# EAGLE design LPC_4TE_3.50controller (EAGLE 5.00)
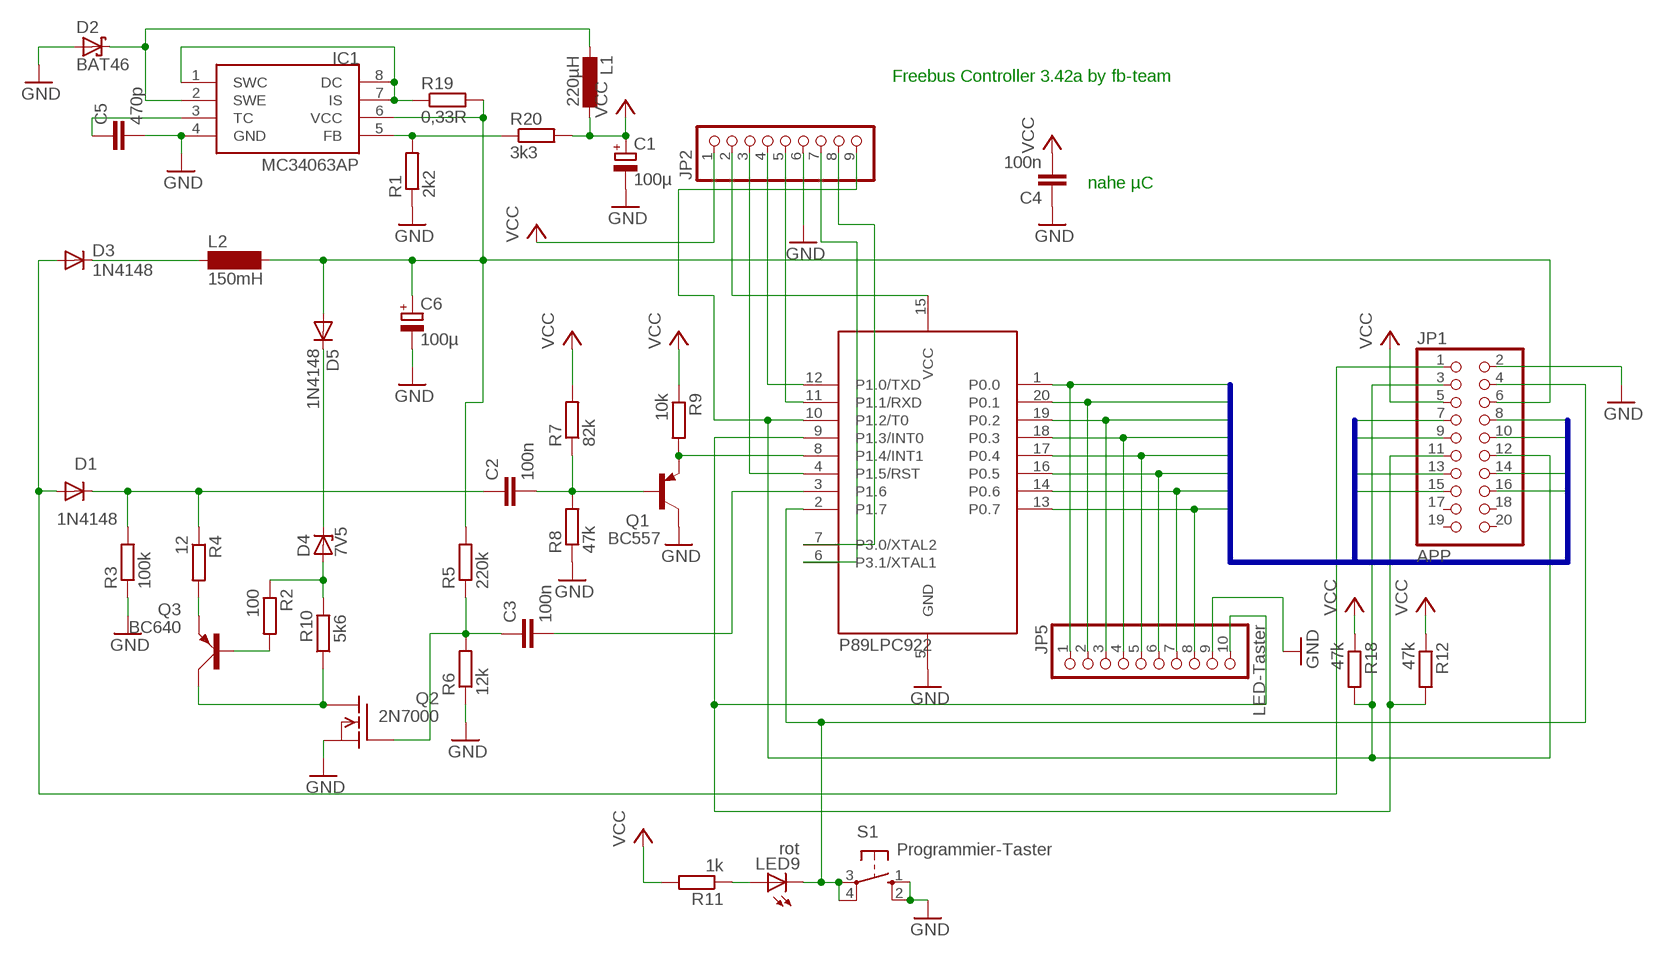
[diagram p0: schematic, sheet 1]

## Parts
C1  100µ  CPOL-EUE5-8.5  [E5-8,5]
C2  100n  C-EU050-024X044  [C050-024X044]
C3  100n  C-EU050-024X044  [C050-024X044]
C4  100n  C-EU050-024X044  [C050-024X044]
C5  470p  C-EU025-024X044  [C025-024X044]
C6  100µ  CPOL-EUE5-8.5  [E5-8,5]
D1  1N4148  [DO35-10]
D2  BAT46  BAT49  [DO41-10]
D3  1N4148  [DO35-10]
D4  7V5  ZPD  [DO35Z10]
D5  1N4148  [DO35-10]
IC1  MC34063AP  [DIL08]
JP1  APP  PINHD-2X10  [2X10]
JP2  PINHD-1X9  [1X09]
JP5  LED-Taster  PINHD-1X10  [1X10]
L1  220µH  L-EU2200-12.7  [2200-12.7]
L2  150mH  SD12-1000  [SD12_1000]
LED9  rot  LED3MM  [LED3MM]
Q1  BC557  [TO92]
Q2  2N7000  VN2222KM  [TO237]
Q3  BC640  [SOT54D]
R1  2k2  R-EU_0207/10  [0207/10]
R2  100  R-EU_0207/10  [0207/10]
R3  100k  R-EU_0207/10  [0207/10]
R4  12  R-EU_0207/10  [0207/10]
R5  220k  R-EU_0207/10  [0207/10]
R6  12k  R-EU_0207/10  [0207/10]
R7  82k  R-EU_0207/10  [0207/10]
R8  47k  R-EU_0207/10  [0207/10]
R9  10k  R-EU_0207/10  [0207/10]
R10  5k6  R-EU_0207/10  [0207/10]
R11  1k  R-EU_0207/10  [0207/10]
R12  47k  R-EU_0207/10  [0207/10]
R18  47k  R-EU_0207/10  [0207/10]
R19  0,33R  R-EU_0207/10  [0207/10]
R20  3k3  R-EU_0207/10  [0207/10]
S1  Programmier-Taster  10-XX  [B3F-10XX]
U1  89LPC922  [DIL20]

## Nets
GND: C1.- C4.1 C5.2 C6.- D2.A IC1.4(GND) JP1.2 JP2.6 JP5.9 Q1.3(C) Q2.3(S) R1.1 R3.1 R6.1 R8.1 S1.1(S) S1.2(S1) U1.5(GND)
N$1: Q1.1(E) R9.2 U1.8(P1.4/INT1)
N$2: C2.2 Q1.2(B) R7.1 R8.2
N$3: IC1.5(FB) R1.2 R20.1
N$4: IC1.1(SWC) IC1.7(IS) IC1.8(DC) R19.1
N$5: C3.2 U1.3(P1.6)
N$6: Q2.1(D) Q3.C R10.1
N$7: C6.+ D5.A IC1.6(VCC) JP1.6 L2.2 R5.2 R19.2
N$8: D3.C L2.1
N$9: C2.1 D1.C R3.2 R4.1
N$10: D2.C IC1.2(SWE) L1.2
N$11: D4.A R2.1 R10.2
N$12: Q3.E R4.2
N$13: C5.1 IC1.3(TC)
N$14: Q3.B R2.2
N$15: JP1.11 JP5.10 R12.2 U1.9(P1.3/INT0)
N$16: D1.A D3.A JP1.1
N$17: JP1.4 LED9.K(C) S1.3(P) S1.4(P1) U1.2(P1.7)
N$19: JP2.7 U1.6(P3.1/XTAL1)
N$20: JP2.8 U1.7(P3.0/XTAL2)
N$29: JP2.4 U1.12(P1.0/TXD)
N$30: JP2.5 U1.11(P1.1/RXD)
N$31: JP2.3 U1.4(P1.5/RST)
N$32: JP2.2 U1.15(VCC)
N$33: JP1.3 JP1.12 JP2.9 R18.2 U1.10(P1.2/T0)
N$34: C3.1 Q2.2(G) R5.1 R6.2
N$40: D4.C D5.C
N$41: LED9.A R11.1
P0.0: JP1.7 JP5.1 U1.1(P0.0)
P0.1: JP1.8 JP5.2 U1.20(P0.1)
P0.2: JP1.9 JP5.3 U1.19(P0.2)
P0.3: JP1.10 JP5.4 U1.18(P0.3)
P0.4: JP1.13 JP5.5 U1.17(P0.4)
P0.5: JP1.14 JP5.6 U1.16(P0.5)
P0.6: JP1.15 JP5.7 U1.14(P0.6)
P0.7: JP1.16 JP5.8 U1.13(P0.7)
VCC: C1.+ C4.2 JP1.5 JP2.1 L1.1 R7.2 R9.1 R11.2 R12.1 R18.1 R20.2
Unconnected: JP1.17 JP1.18 JP1.19 JP1.20

## Buses
P0.[0..7]

## Notes on the sheet
- Freebus Controller 3.42a by fb-team
- nahe µC
- P89LPC922

## Library data of the parts
C1 C6 = rcl:CPOL-EU: POLARIZED CAPACITOR, European symbol
C2-C5 = rcl:C-EU: CAPACITOR, European symbol
D1 D3 D5 = diode:1N4148: DIODE high speed (Philips)
D2 = diode:BAT49: DIODE small signal diode
D4 = diode:ZPD: Z DIODE 500 mW
IC1 = mc34063:MC34063
JP1 = pinhead:PINHD-2X10: PIN HEADER
JP2 = pinhead:PINHD-1X9: PIN HEADER
JP5 = pinhead:PINHD-1X10: PIN HEADER
L1 = rcl:L-EU: INDUCTOR, European symbol
L2 = inductor-neosid:SD12: INDUCTOR nominal inductance
LED9 = led:LED: LED OSRAM: - CHIPLED LG R971, LG N971, LY N971, LG Q971, LY Q971, LO R971, LY R971 LH N974, LH R974 LS Q976, LO Q976, LY Q976 LO Q996 - Hyper CHIPLED LW Q18S LB Q993, LB Q99A, LB R99A - SideLED LS A670, LO A670, LY A670, LG A670, LP A670 LB A673, LV A673, LT A673, LW A673 LH A674 LY A675 LS A676, LA A676, LO A676, LY A676, LW A676 LS A679, LY A679, LG A679 - Hyper Micro SIDELED® LS Y876, LA Y876, LO Y876, LY Y876 LT Y87S - SmartLED LW L88C, LW L88S LB L89C, LB L89S, LG L890 LS L89K, LO L89K, LY L89K LS L896, LA L896, LO L896, LY L896 - TOPLED LS T670, LO T670, LY T670, LG T670, LP T670 LSG T670, LSP T670, LSY T670, LOP T670, LYG T670 LG T671, LOG T671, LSG T671 LB T673, LV T673, LT T673, LW T673 LH T674 LS T676, LA T676, LO T676, LY T676, LB T676, LH T676, LSB T676, LW T676 LB T67C, LV T67C, LT T67C, LS T67K, LO T67K, LY T67K, LW E67C LS E67B, LA E67B, LO E67B, LY E67B, LB E67C, LV E67C, LT E67C LW T67C LS T679, LY T679, LG T679 LS T770, LO T770, LY T770, LG T770, LP T770 LB T773, LV T773, LT T773, LW T773 LH T774 LS E675, LA E675, LY E675, LS T675 LS T776, LA T776, LO T776, LY T776, LB T776 LHGB T686 LT T68C, LB T68C - Hyper Mini TOPLED® LB M676 - Mini TOPLED Santana® LG M470 LS M47K, LO M47K, LY M47K Source: http://www.osram.convergy.de - LUMILED® LXK2-PW12-R00, LXK2-PW12-S00, LXK2-PW14-U00, LXK2-PW14-V00 LXK2-PM12-R00, LXK2-PM12-S00, LXK2-PM14-U00 LXK2-PE12-Q00, LXK2-PE12-R00, LXK2-PE12-S00, LXK2-PE14-T00, LXK2-PE14-U00 LXK2-PB12-K00, LXK2-PB12-L00, LXK2-PB12-M00, LXK2-PB14-N00, LXK2-PB14-P00, LXK2-PB14-Q00 LXK2-PR12-L00, LXK2-PR12-M00, LXK2-PR14-Q00, LXK2-PR14-R00 LXK2-PD12-Q00, LXK2-PD12-R00, LXK2-PD12-S00 LXK2-PH12-R00, LXK2-PH12-S00 LXK2-PL12-P00, LXK2-PL12-Q00, LXK2-PL12-R00 Source: www.luxeon.com
Q1 = transistor-pnp:BC557: PNP Transistor
Q2 = transistor-fet:VN2222KM: N-Channel Enhancement MOSFET (VMOS); 60V; 0,5A; 7,5Ohm
Q3 = transistor-small-signal:BC640: PNP TRANSISTOR
R1-R12 R18-R20 = rcl:R-EU_: RESISTOR, European symbol
S1 = switch-omron:10-XX: OMRON SWITCH
U1 = micro-philips:89LPC922

## Board
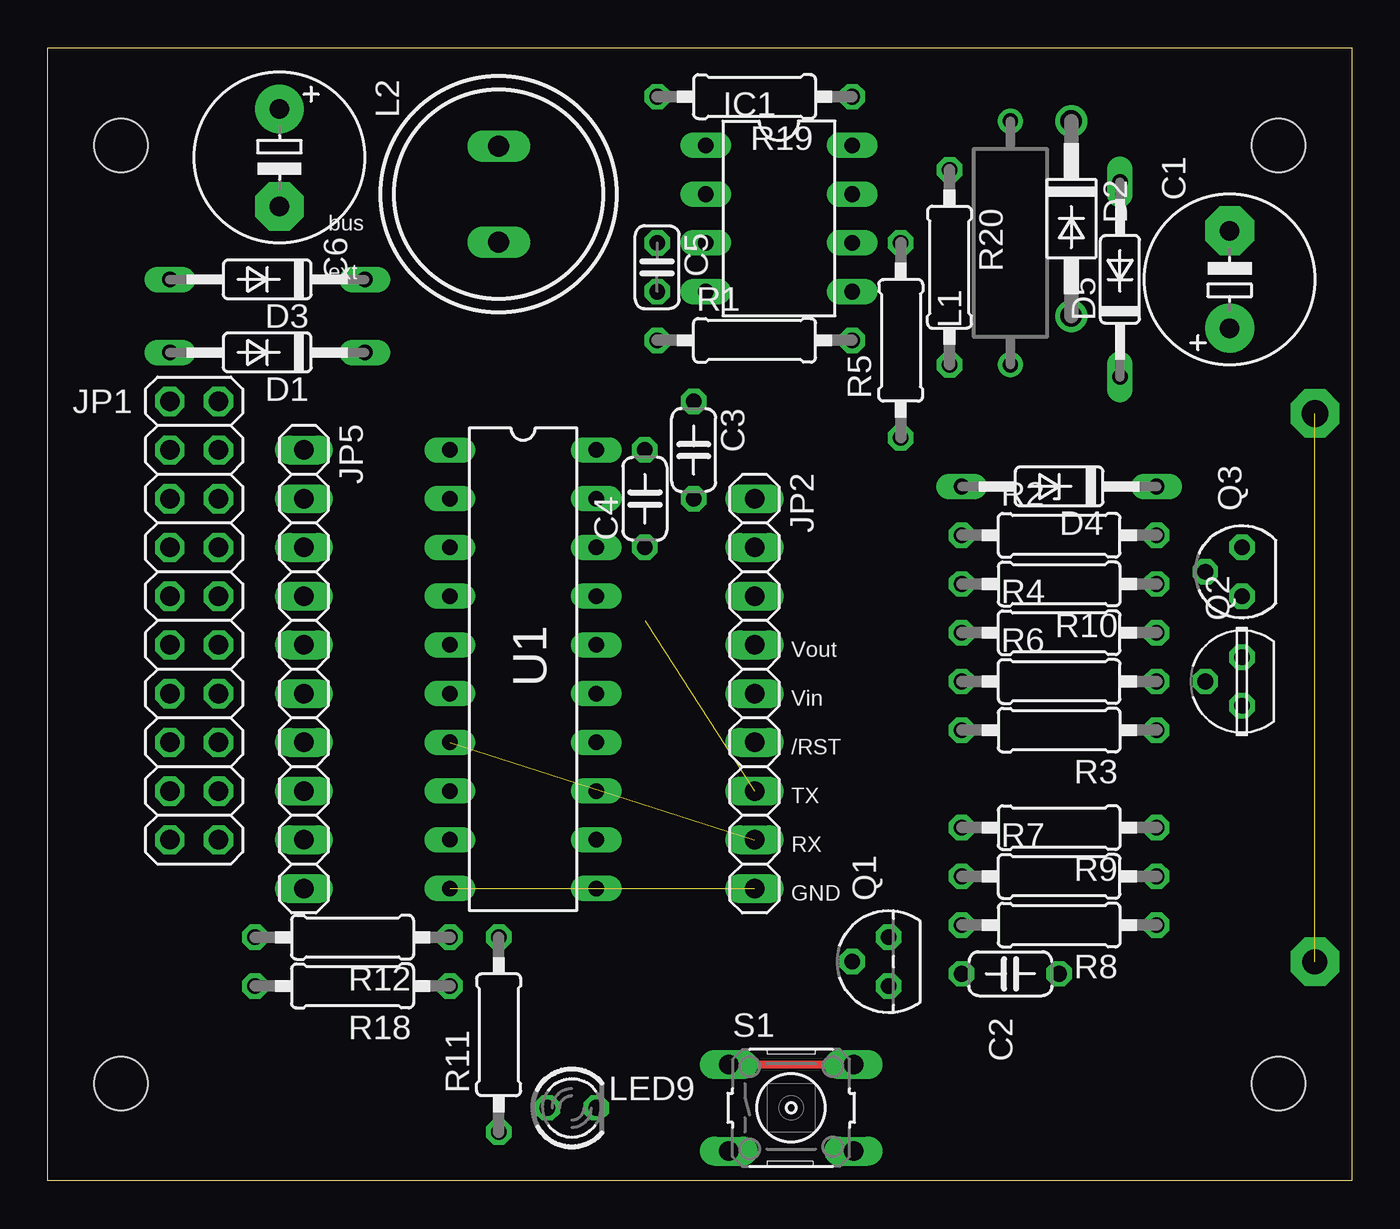
[diagram p1: board, top side]
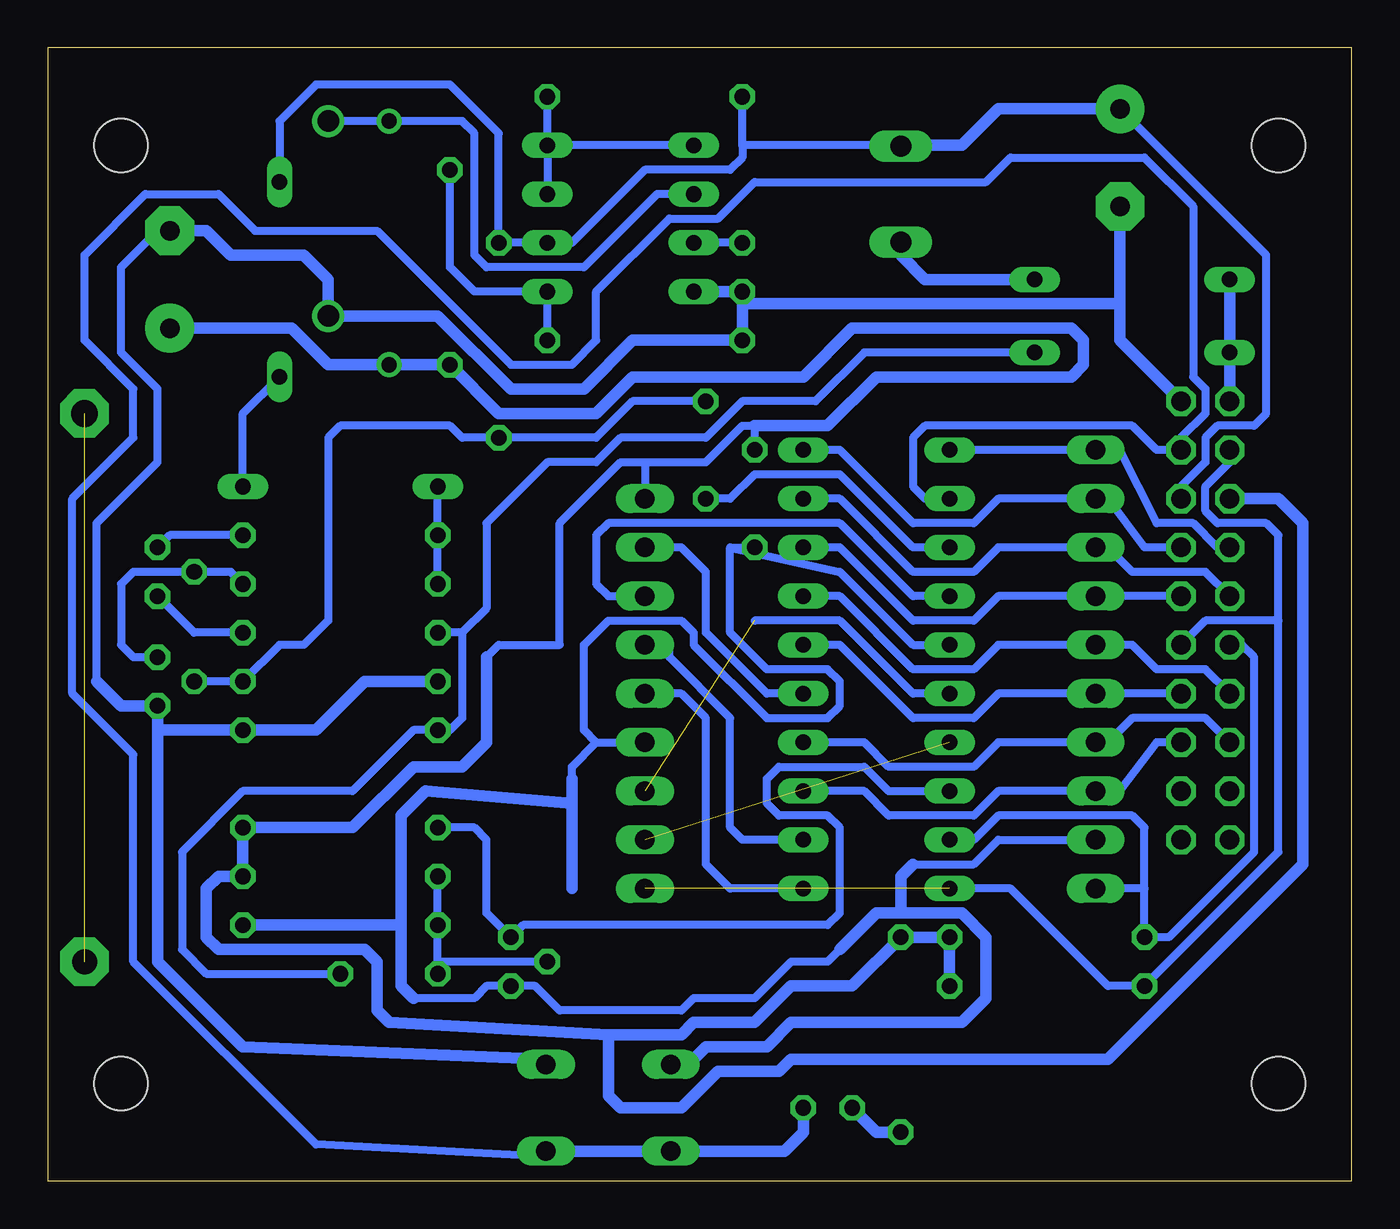
[diagram p2: board, bottom side, seen from below]

Size 67.94 x 59.05 mm. Coordinates in mm from the lower left corner, seen from the top.
Outline: 0,0 0,59.05 67.94,59.05 67.94,0 0,0
Copper layers (1*16): Top 0.035mm / dielectric 1.5mm / Bottom 0.035mm
Design rules "default *": minimum track width 10mil, minimum drill 24mil, track to track 12mil, track to pad 12mil, pad to pad 12mil, via to via 12mil, smd to smd 8mil, copper to edge 20mil, drill to drill 8mil, minimum pad ring 10mil, minimum via ring 8mil, stop-mask expansion 4mil, vias tented up to drill 0mil, thermal gap 10mil
Holes 2.8 mm at 3.81,53.98 64.14,53.98 64.14,5.08 3.81,5.08

### Footprints (pad centres in the part's own frame; a part is rotated, then mirrored left to right if it is on the bottom)
E5-8,5 = drill 1.016 pad 2.54 round: + -2.54,0 | drill 1.016 pad 2.54 octagon: - 2.54,0
C050-024X044 = drill 0.813 octagon: 1 -2.54,0; 2 2.54,0
C025-024X044 = drill 0.813 octagon: 1 -1.27,0; 2 1.27,0
DO35-10 = drill 0.813 long: A 5.08,0; C -5.08,0
DO41-10 = drill 1.118 round: A 5.08,0; C -5.08,0
DO35Z10 = drill 0.813 long: A 5.08,0; C -5.08,0
DIL08 = drill 0.813 long: 1 -3.81,-3.81; 2 -1.27,-3.81; 3 1.27,-3.81; 4 3.81,-3.81; 5 3.81,3.81; 6 1.27,3.81; 7 -1.27,3.81; 8 -3.81,3.81
2X10 = drill 1.016 octagon: 1 -11.43,-1.27; 2 -11.43,1.27; 3 -8.89,-1.27; 4 -8.89,1.27; 5 -6.35,-1.27; 6 -6.35,1.27; 7 -3.81,-1.27; 8 -3.81,1.27; 9 -1.27,-1.27; 10 -1.27,1.27; 11 1.27,-1.27; 12 1.27,1.27; 13 3.81,-1.27; 14 3.81,1.27; 15 6.35,-1.27; 16 6.35,1.27; 17 8.89,-1.27; 18 8.89,1.27; 19 11.43,-1.27; 20 11.43,1.27
1X09 = drill 1.016 long: 1 -10.16,0; 2 -7.62,0; 3 -5.08,0; 4 -2.54,0; 5 0,0; 6 2.54,0; 7 5.08,0; 8 7.62,0; 9 10.16,0
1X10 = drill 1.016 long: 1 -11.43,0; 2 -8.89,0; 3 -6.35,0; 4 -3.81,0; 5 -1.27,0; 6 1.27,0; 7 3.81,0; 8 6.35,0; 9 8.89,0; 10 11.43,0
2200-12.7 = drill 0.8 pad 1.27 round: 1 -6.35,0; 2 6.35,0
SD12_1000 = drill 1.1 long: 1 -2.5,0; 2 2.5,0
LED3MM = drill 0.813 octagon: A -1.27,0; K 1.27,0
TO92 = drill 0.813 octagon: 1 1.27,0; 2 0,1.905; 3 -1.27,0
TO237 = drill 0.813 octagon: 1 1.27,0; 2 0,1.905; 3 -1.27,0
SOT54D = drill 0.813 octagon: B 1.27,0; C 0,1.905; E -1.27,0
0207/10 = drill 0.813 octagon: 1 -5.08,0; 2 5.08,0
B3F-10XX = drill 1.016 long: 1 -3.251,2.261; 2 3.251,2.261; 3 -3.251,-2.261; 4 3.251,-2.261
DIL20 = drill 0.813 long: 1 -11.43,-3.81; 2 -8.89,-3.81; 3 -6.35,-3.81; 4 -3.81,-3.81; 5 -1.27,-3.81; 6 1.27,-3.81; 7 3.81,-3.81; 8 6.35,-3.81; 9 8.89,-3.81; 10 11.43,-3.81; 11 11.43,3.81; 12 8.89,3.81; 13 6.35,3.81; 14 3.81,3.81; 15 1.27,3.81; 16 -1.27,3.81; 17 -3.81,3.81; 18 -6.35,3.81; 19 -8.89,3.81; 20 -11.43,3.81

### Placement (x,y rotation side)
C1  61.59,46.99 90 top
C2  50.16,10.79 180 top
C3  33.66,38.1 270 top
C4  31.11,35.56 90 top
C5  31.75,47.62 270 top
C6  12.06,53.34 270 top
D1  11.43,43.18 180 top
D2  53.34,50.16 270 top
D3  11.43,46.99 180 top
D4  52.7,36.2 180 top
D5  55.88,46.99 90 top
IC1  38.1,50.16 270 top
JP1  7.62,29.21 270 top
JP2  36.83,25.4 270 top
JP5  13.34,26.67 270 top
L1  50.16,48.9 90 top
L2  23.5,51.44 90 top
LED9  27.3,3.81 0 top
Q1  43.81,11.43 90 top
Q2  62.23,26.04 90 top
Q3  62.23,31.75 90 top
R1  36.83,43.81 0 top
R2  52.7,33.66 0 top
R3  52.7,23.5 180 top
R4  52.7,28.57 0 top
R5  44.45,43.81 90 top
R6  52.7,26.04 0 top
R7  52.7,15.88 0 top
R8  52.7,13.34 180 top
R9  52.7,18.41 180 top
R10  52.7,31.11 180 top
R11  23.5,7.62 90 top
R12  15.88,12.7 180 top
R18  15.88,10.16 180 top
R19  36.83,56.52 180 top
R20  46.99,47.62 270 top
S1  38.73,3.81 0 top
U1  24.77,26.67 270 top

### Tracks (layer width: path | path; a pad name or v marks a point on that pad's centre or on a via)
GND  (1 unrouted)
  Top 0.406: S1.2 35.92,6.07 35.56,5.71 35.48,5.79 S1.1 35.48,6.27 35.56,6.35
  Bottom 0.406: U1.5 22.86,27.94 26.67,31.75 32.38,33.02 | JP5.9 18.41,17.78 19.68,16.51 22.86,16.51 | 32.38,33.02 C4.1 | 32.38,33.02 32.38,28.57 30.48,26.67 27.3,26.67 26.67,26.04 26.67,24.77 27.3,24.13 30.48,24.13 34.29,27.94 34.29,28.57 34.92,29.21 38.73,29.21 40.01,27.94 40.01,23.5 39.37,22.86 | 65.41,26.04 65.41,34.29 62.23,37.47 62.23,41.27 64.14,43.18 64.14,47.62 62.23,49.53 C1.- | 39.37,22.86 JP2.6 | 40.64,20.95 40.64,21.59 39.37,22.86 | 48.9,9.53 45.72,9.53 45.09,10.16 Q1.3 42.55,10.16 41.27,8.89 34.92,8.89 34.29,9.53 31.11,9.53 29.21,11.43 27.3,11.43 26.67,12.06
  Bottom 0.61: JP1.2 12.06,43.81 12.06,45.72 | 12.06,45.72 C6.- | 40.64,19.68 40.64,20.95 | 40.64,19.68 40.64,15.24 | 48.9,9.53 49.53,10.16 49.53,13.34 | 49.53,13.34 49.53,19.05 48.26,20.32 40.64,19.68 | 49.53,13.34 R8.1 | 23.5,13.97 20.32,13.97 19.05,12.7 19.05,9.53 20.32,8.26 29.21,8.26 30.48,6.99 33.66,6.99 34.29,6.35 35.56,6.35 35.48,6.27 | 23.5,13.97 23.5,15.88 22.86,16.51 | 26.67,12.06 24.77,13.97 23.5,13.97 | S1.2 41.99,6.27 41.91,6.35 57.78,6.99 62.23,11.43 62.23,23.5 | C1.- 59.69,49.53 58.42,48.26 54.61,48.26 53.34,46.99 D2.A 47.62,45.09 43.81,41.27 40.01,41.27 37.47,43.81 R1.1 31.75,45.72 | R6.1 51.44,26.04 53.98,23.5 R3.1 62.23,23.5 | 65.41,26.04 64.14,24.77 Q2.3 62.23,23.5 | IC1.4 C5.2 31.75,45.72 | 31.75,45.72 12.06,45.72
N$1
  Bottom 0.406: U1.8 24.13,20.32 25.4,21.59 29.84,21.59 30.48,20.95 30.48,19.68 29.84,19.05 27.3,19.05 26.67,18.41 26.67,13.97 27.3,13.34 43.18,13.34 Q1.1 45.09,13.97 45.09,17.78 45.72,18.41 R9.2
N$2
  Bottom 0.406: 47.62,11.43 C2.2 | 47.62,11.43 R8.2 R7.1 | Q1.2 47.62,11.43
N$3
  Bottom 0.406: R1.2 IC1.5 45.72,46.35 46.99,47.62 R20.1
N$4
  Bottom 0.406: IC1.1 IC1.8 | IC1.8 IC1.7 | IC1.8 R19.1
N$5
  Bottom 0.406: U1.3 22.86,33.02 26.67,36.83 31.11,36.83 32.38,35.56 C3.2
N$6
  Bottom 0.406: R10.1 58.42,31.75 Q3.C 63.5,31.75 64.14,31.11 64.14,27.94 63.5,27.3 Q2.1
N$7
  Bottom 0.406: JP1.6 8.89,36.2 7.62,37.47 7.62,38.73 6.99,39.37 5.08,39.37 4.45,40.01 4.45,48.26 C6.+ | D5.A 55.88,55.24 53.98,57.15 46.99,57.15 44.45,54.61 R5.2 IC1.6 40.64,48.9 36.83,52.7 32.38,52.7 31.75,53.34 31.75,53.98 | 31.75,53.98 R19.2 | 23.5,53.98 31.75,53.98
  Bottom 0.61: C6.+ 18.41,55.88 20.32,53.98 23.5,53.98 L2.2
N$8
  Bottom 0.61: D3.C 22.23,46.99 23.5,48.26 L2.1
N$9
  Bottom 0.406: C2.1 59.69,10.79 60.96,12.06 60.96,17.14 57.78,20.32 52.07,20.32 48.9,23.5 R3.2 46.99,23.5 46.35,24.13 46.35,28.57 | 46.35,28.57 R4.1 | D1.C 25.4,43.18 27.94,40.64 31.75,40.64 33.66,38.73 38.1,38.73 39.37,37.47 41.91,37.47 45.09,34.29 45.09,29.84 46.35,28.57
N$10
  Bottom 0.406: IC1.2 36.2,51.44 40.01,47.62 45.09,47.62 45.72,48.26 45.72,54.61 46.35,55.24 L1.2 D2.C
N$11
  Bottom 0.406: D4.A R2.1 R10.2
N$12
  Bottom 0.406: R4.2 60.33,28.57 Q3.E
N$13
  Bottom 0.406: C5.1 IC1.3
N$14
  Bottom 0.406: Q3.B 61.59,33.66 R2.2
N$15
  Bottom 0.406: U1.9 19.68,17.78 18.41,19.05 11.43,19.05 10.79,18.41 10.79,15.24 | JP1.11 5.71,27.94 5.08,27.3 5.08,17.14 9.53,12.7 R12.2 10.79,15.24 | 10.79,15.24 JP5.10
N$16
  Bottom 0.61: JP1.1 D1.A D3.A
N$17
  Bottom 0.406: U1.2 22.23,35.56 22.86,36.2 22.86,38.73 22.23,39.37 11.43,39.37 10.16,38.1 JP1.4 8.89,38.73 7.62,40.01 7.62,41.27 8.26,41.91 8.26,50.8 10.79,53.34 17.78,53.34 19.05,52.07 31.11,52.07 33.02,50.16 35.56,50.16 39.37,46.35 39.37,43.81 40.64,42.55 43.81,42.55 50.8,49.53 57.15,49.53 59.05,51.44 62.87,51.44 66.04,48.26 66.04,43.81 63.5,41.27 63.5,38.73 66.67,35.56 66.67,25.4 63.5,22.23 63.5,11.43 53.98,1.91 41.91,1.27 41.99,1.35 S1.4
  Bottom 0.61: 35.56,1.55 S1.3 29.57,1.55 28.57,2.54 LED9.K | 35.56,1.55 S1.4 | 35.56,1.55 35.56,1.27
N$18  (via drill 1.3 pad 2.54, 1.4 pad 2.54)  (1 unrouted)
  other vias: 66.04,11.43 66.04,40.01
N$19  (1 unrouted)
  Bottom 0.406: U1.6 22.86,25.4 26.67,29.21 31.11,29.21
N$20  (1 unrouted)
N$29
  Bottom 0.406: 29.84,17.78 U1.12 31.75,17.78 32.38,18.41 32.38,24.13 35.56,27.3 35.56,27.94 JP2.4
N$30
  Bottom 0.406: JP2.5 34.92,25.4 33.66,24.13 33.66,16.51 32.38,15.24 U1.11
N$31
  Bottom 0.406: U1.4 22.86,30.48 26.67,34.29 38.73,34.29 39.37,33.66 39.37,31.11 38.73,30.48 JP2.3
N$32
  Bottom 0.406: U1.15 30.48,25.4 33.66,28.57 33.66,31.75 34.92,33.02 JP2.2
N$33  (1 unrouted)
  Bottom 0.406: U1.10 17.78,15.24 12.7,10.16 R18.2 3.81,17.14 3.81,29.21 | 3.81,29.21 7.62,29.21 JP1.12 | JP1.3 6.35,37.47 7.62,36.2 7.62,34.92 6.99,34.29 4.45,34.29 3.81,33.66 3.81,29.21
N$34
  Bottom 0.406: Q2.2 R6.2 55.88,27.94 54.61,27.94 53.34,29.21 53.34,38.73 52.7,39.37 46.99,39.37 46.35,38.73 R5.1 39.37,38.73 37.47,40.64 C3.1
N$40
  Bottom 0.406: D5.C 57.78,40.01 D4.C
N$41
  Bottom 0.61: R11.1 24.77,2.54 LED9.A
P0.0
  Bottom 0.406: JP1.7 6.99,33.02 8.26,34.29 10.16,34.29 12.06,38.1 JP5.1 U1.1
P0.1
  Bottom 0.406: U1.20 26.67,38.1 22.86,34.29 19.68,34.29 18.41,35.56 JP5.2 12.7,35.56 10.79,33.02 JP1.8
P0.2
  Bottom 0.406: JP1.9 7.62,31.75 11.43,31.75 12.7,33.02 JP5.3 18.41,33.02 19.68,31.75 22.86,31.75 26.67,35.56 U1.19
P0.3
  Bottom 0.406: U1.18 26.67,33.02 22.86,29.21 19.68,29.21 18.41,30.48 JP5.4 JP1.10
P0.4
  Bottom 0.406: JP1.13 7.62,26.67 10.16,26.67 11.43,27.94 JP5.5 18.41,27.94 19.68,26.67 22.86,26.67 26.67,30.48 U1.17
P0.5
  Bottom 0.406: U1.16 26.67,27.94 22.86,24.13 19.68,24.13 18.41,25.4 JP5.6 JP1.14
P0.6
  Bottom 0.406: JP1.15 7.62,24.13 11.43,24.13 12.7,22.86 JP5.7 18.41,22.86 19.68,21.59 24.13,21.59 25.4,22.86 U1.14
P0.7
  Bottom 0.406: U1.13 25.4,20.32 24.13,19.05 19.68,19.05 18.41,20.32 JP5.8 12.06,20.32 10.16,22.86 JP1.16
VCC
  Bottom 0.406: 45.09,27.3 44.45,27.94 41.27,27.94 41.27,34.29 38.1,37.47 36.83,37.47 | C4.2 31.11,39.37 31.75,39.37 33.66,37.47 36.83,37.47 | 36.83,37.47 JP2.1
  Bottom 0.61: R18.1 R12.1 R11.2 26.04,10.16 29.21,10.16 31.11,8.26 34.29,8.26 34.92,7.62 38.73,7.62 | 45.09,27.3 45.09,22.86 46.35,21.59 48.9,21.59 52.07,18.41 R9.1 R7.2 59.05,15.88 59.69,15.24 59.69,12.7 59.05,12.06 51.44,12.06 50.8,11.43 50.8,8.89 50.16,8.26 38.73,7.62 | C1.+ 55.24,44.45 53.34,42.55 L1.1 R20.2 44.45,40.01 39.37,40.01 37.47,41.91 28.57,41.91 26.04,44.45 14.61,44.45 13.97,43.81 13.97,42.55 14.61,41.91 24.77,41.91 27.3,39.37 31.11,39.37 | JP1.5 3.81,35.56 2.54,34.29 2.54,16.51 12.7,6.35 29.21,6.35 29.84,5.71 33.02,5.71 34.92,3.81 38.1,3.81 38.73,4.45 38.73,7.62

### Text on the board
tPlace: bus | ext | Vout | Vin | /RST | TX | RX | GND